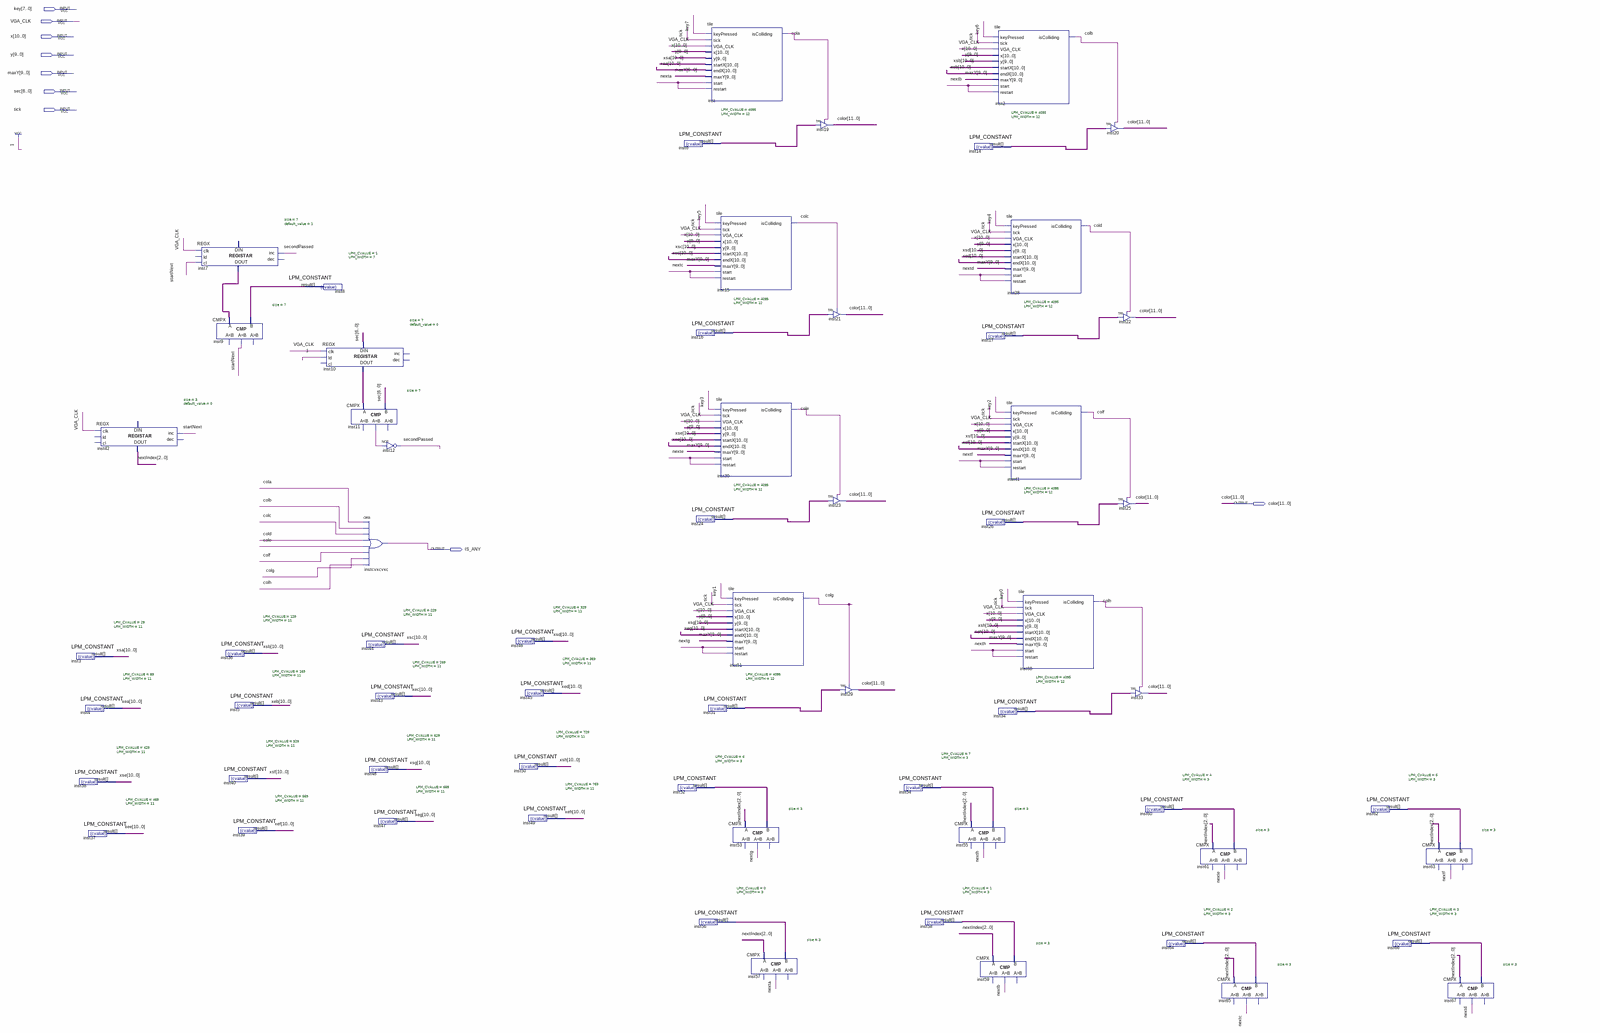
[diagram p0: schematic sheet, whole]
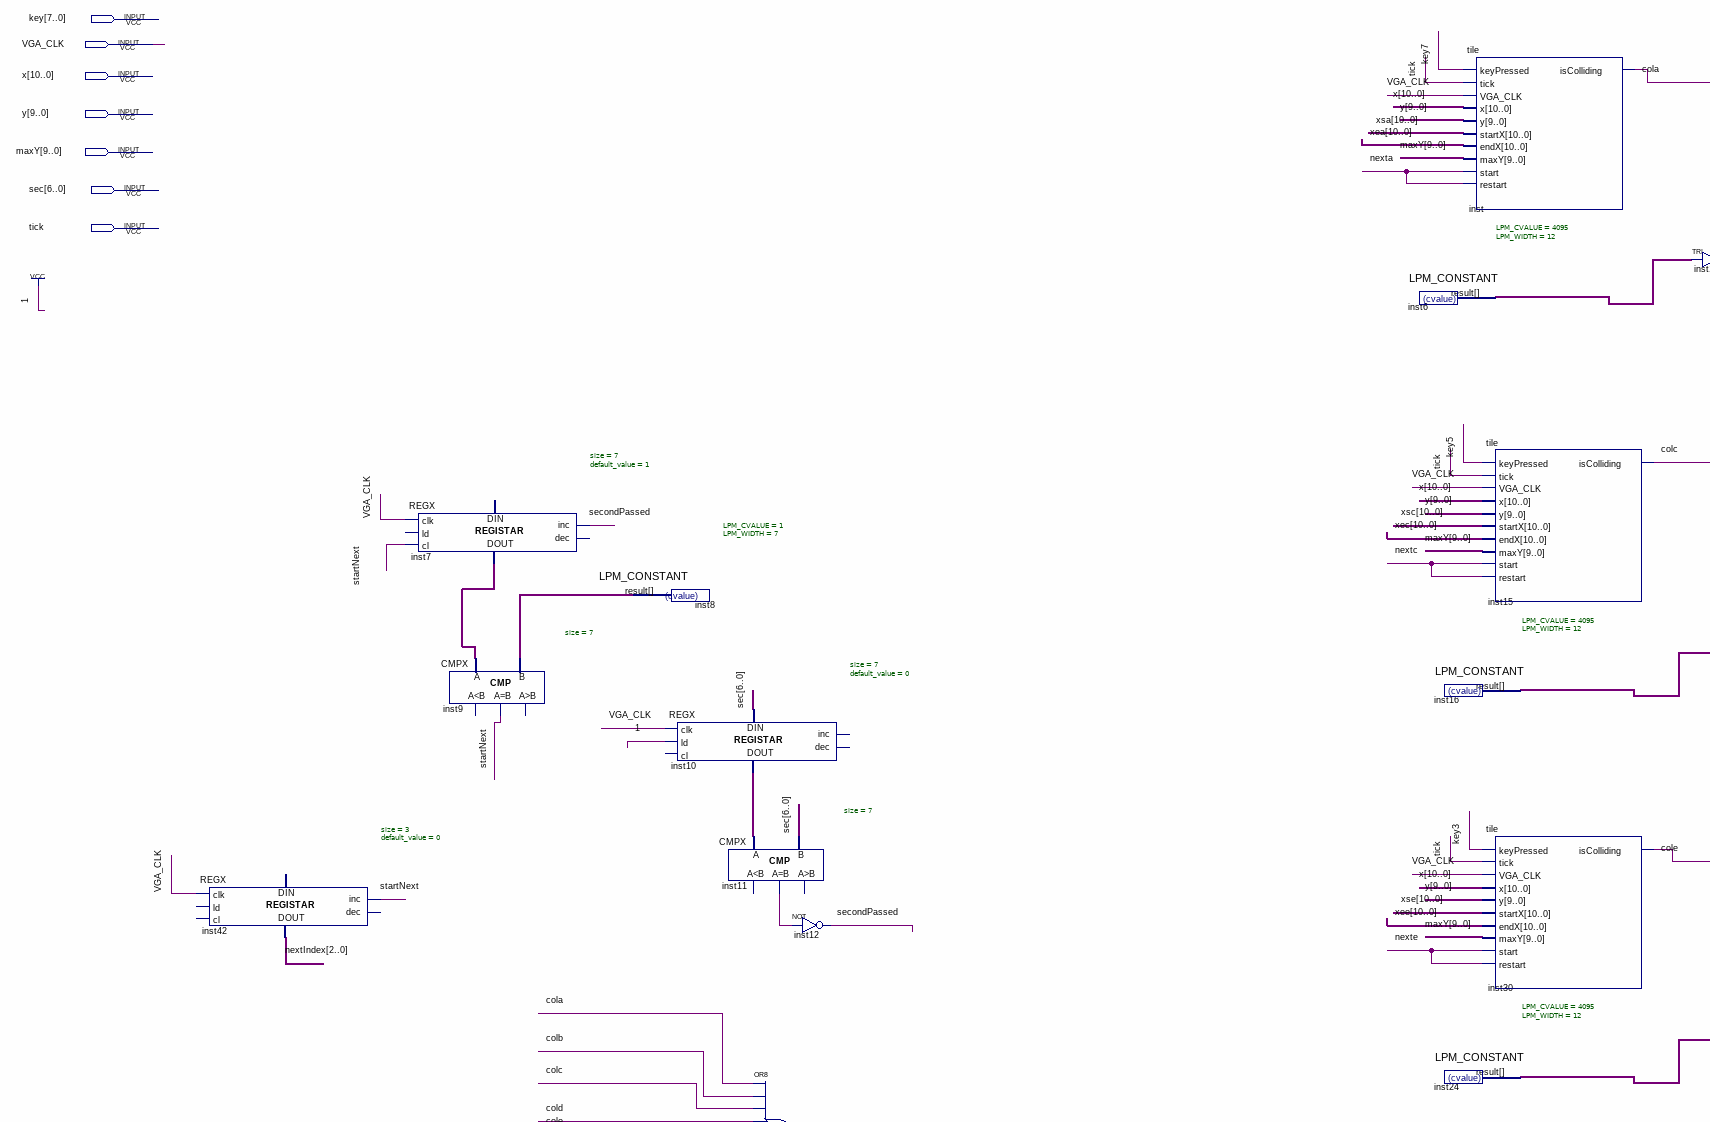
[diagram p1: schematic sheet, upper left part]
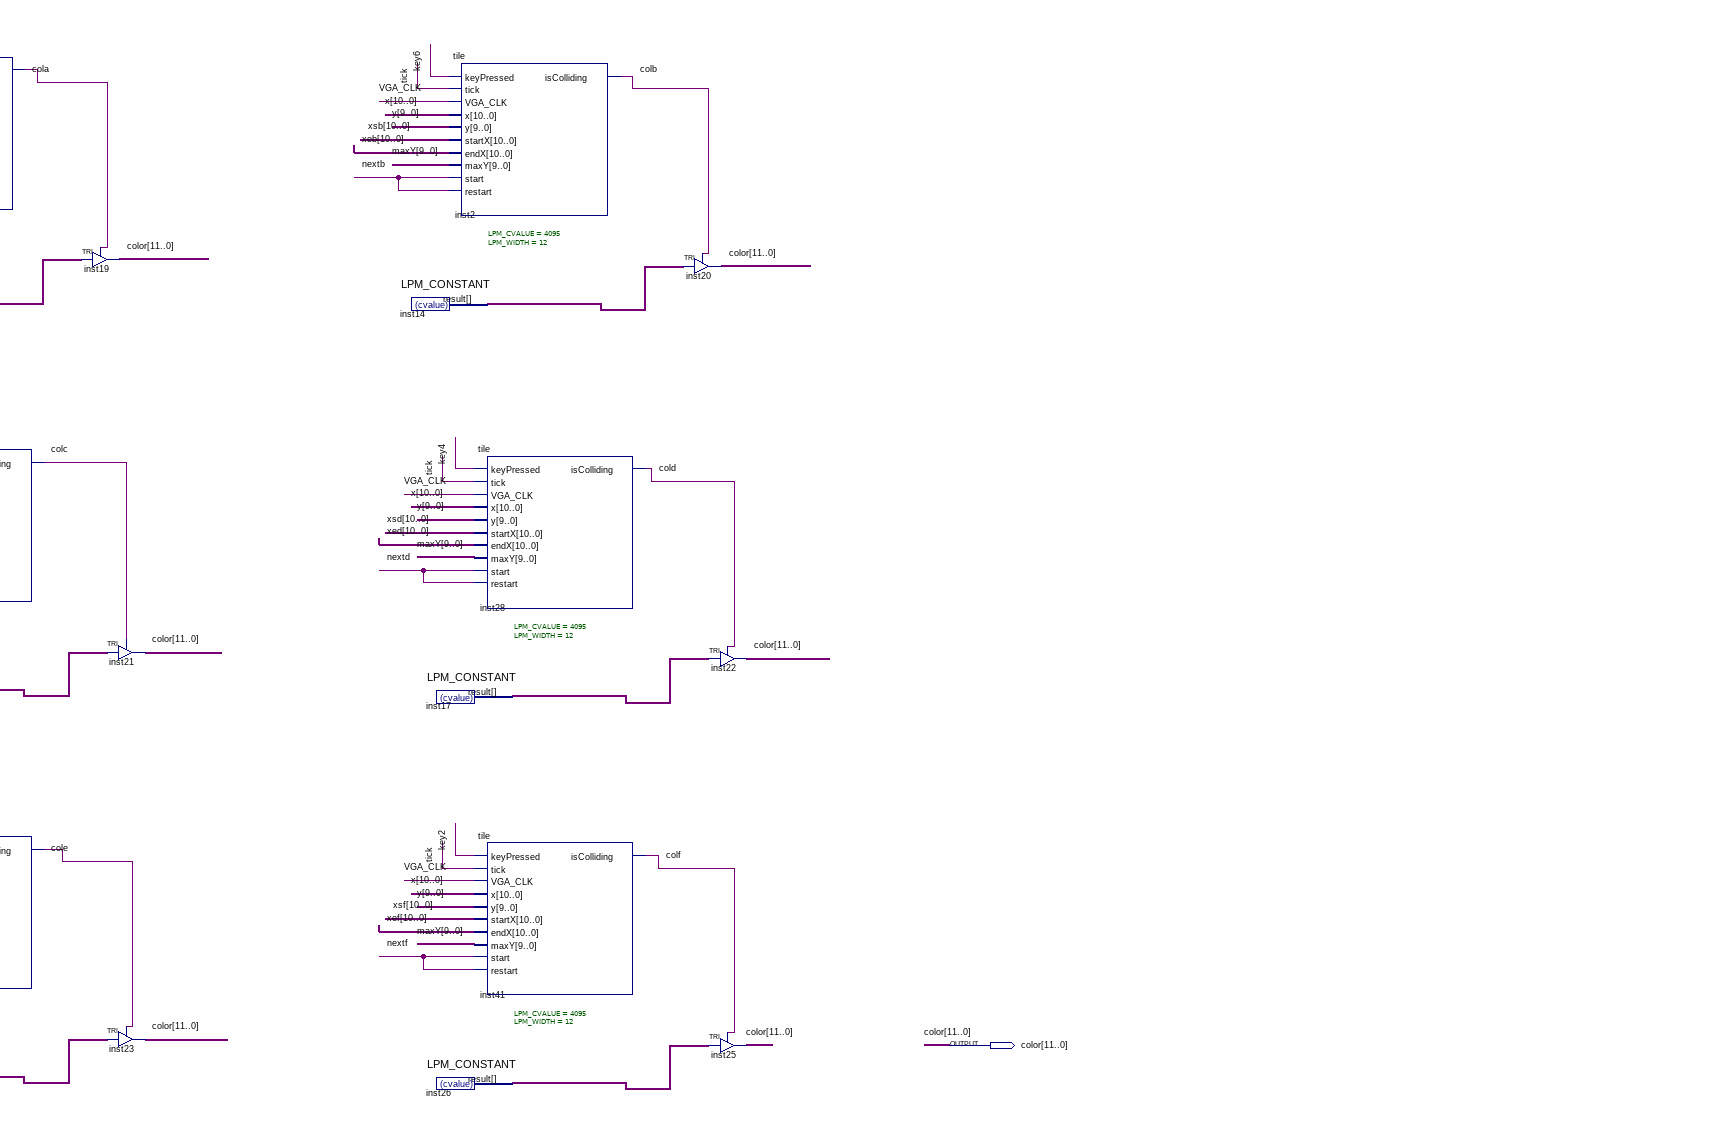
[diagram p2: schematic sheet, upper right part]
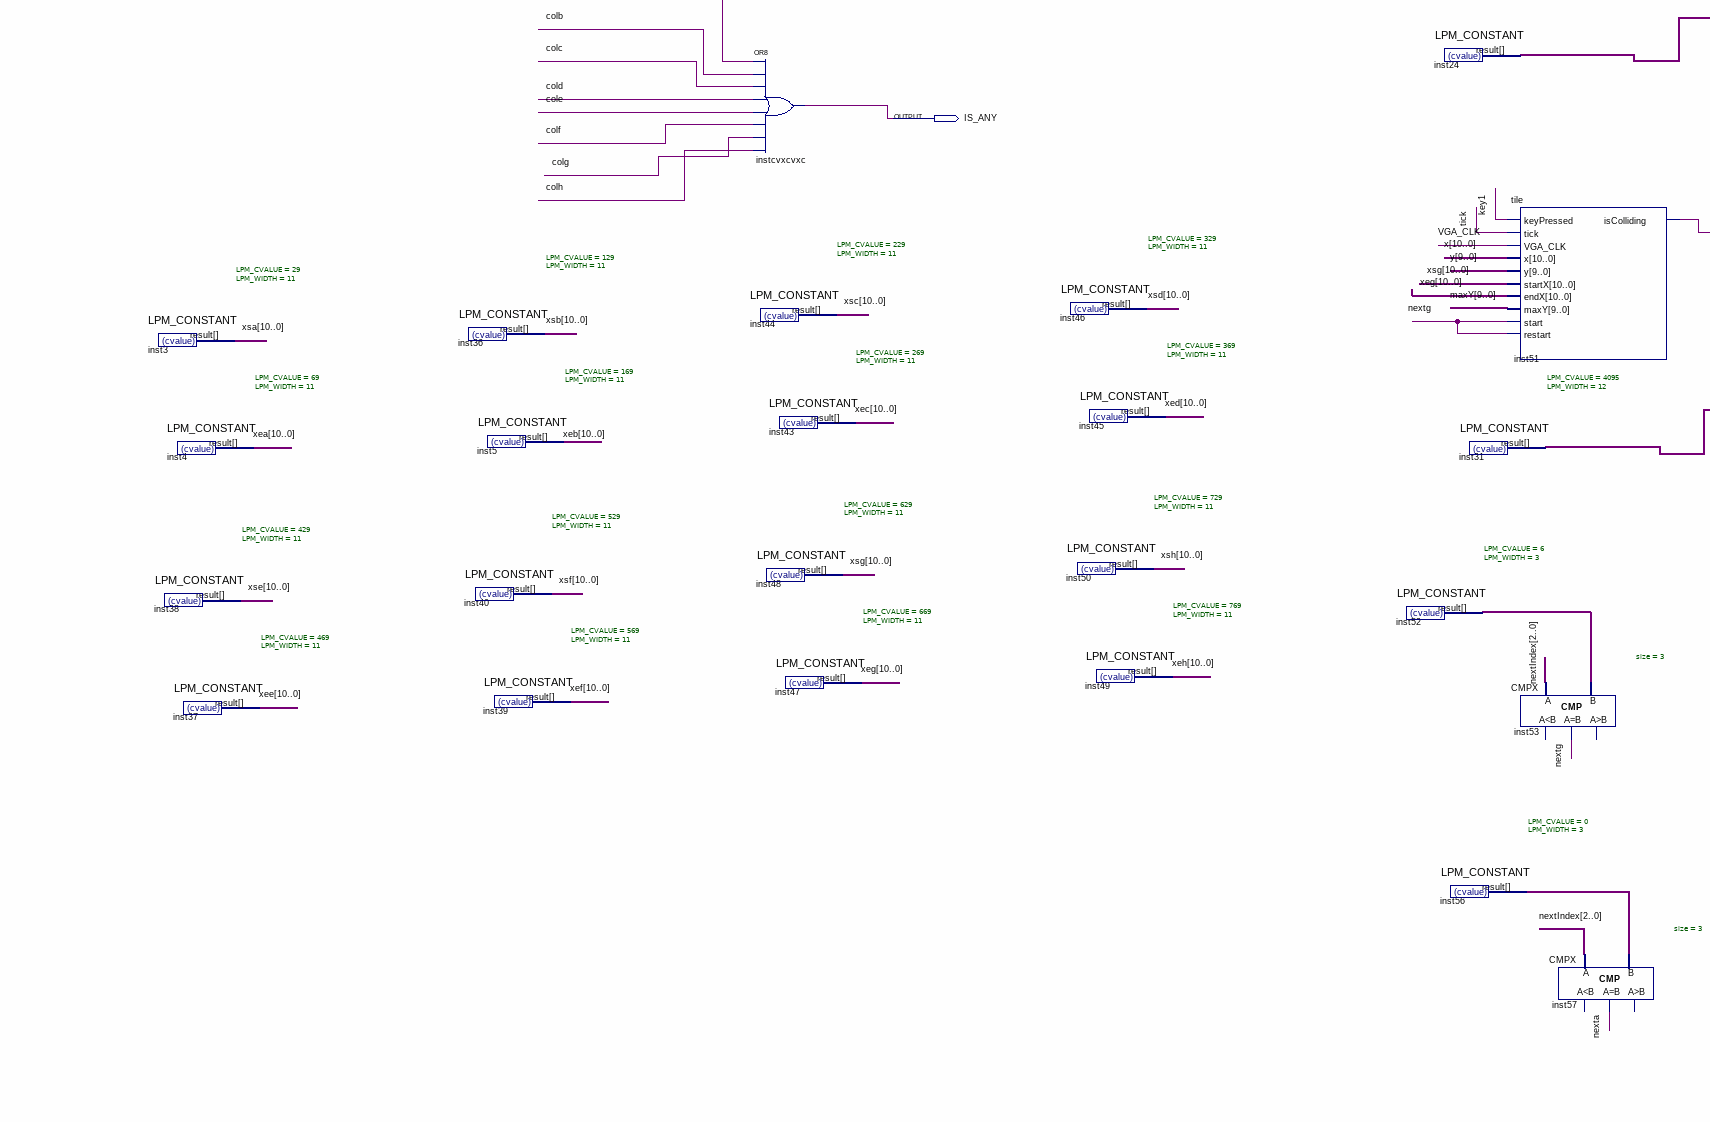
[diagram p3: schematic sheet, lower left part]
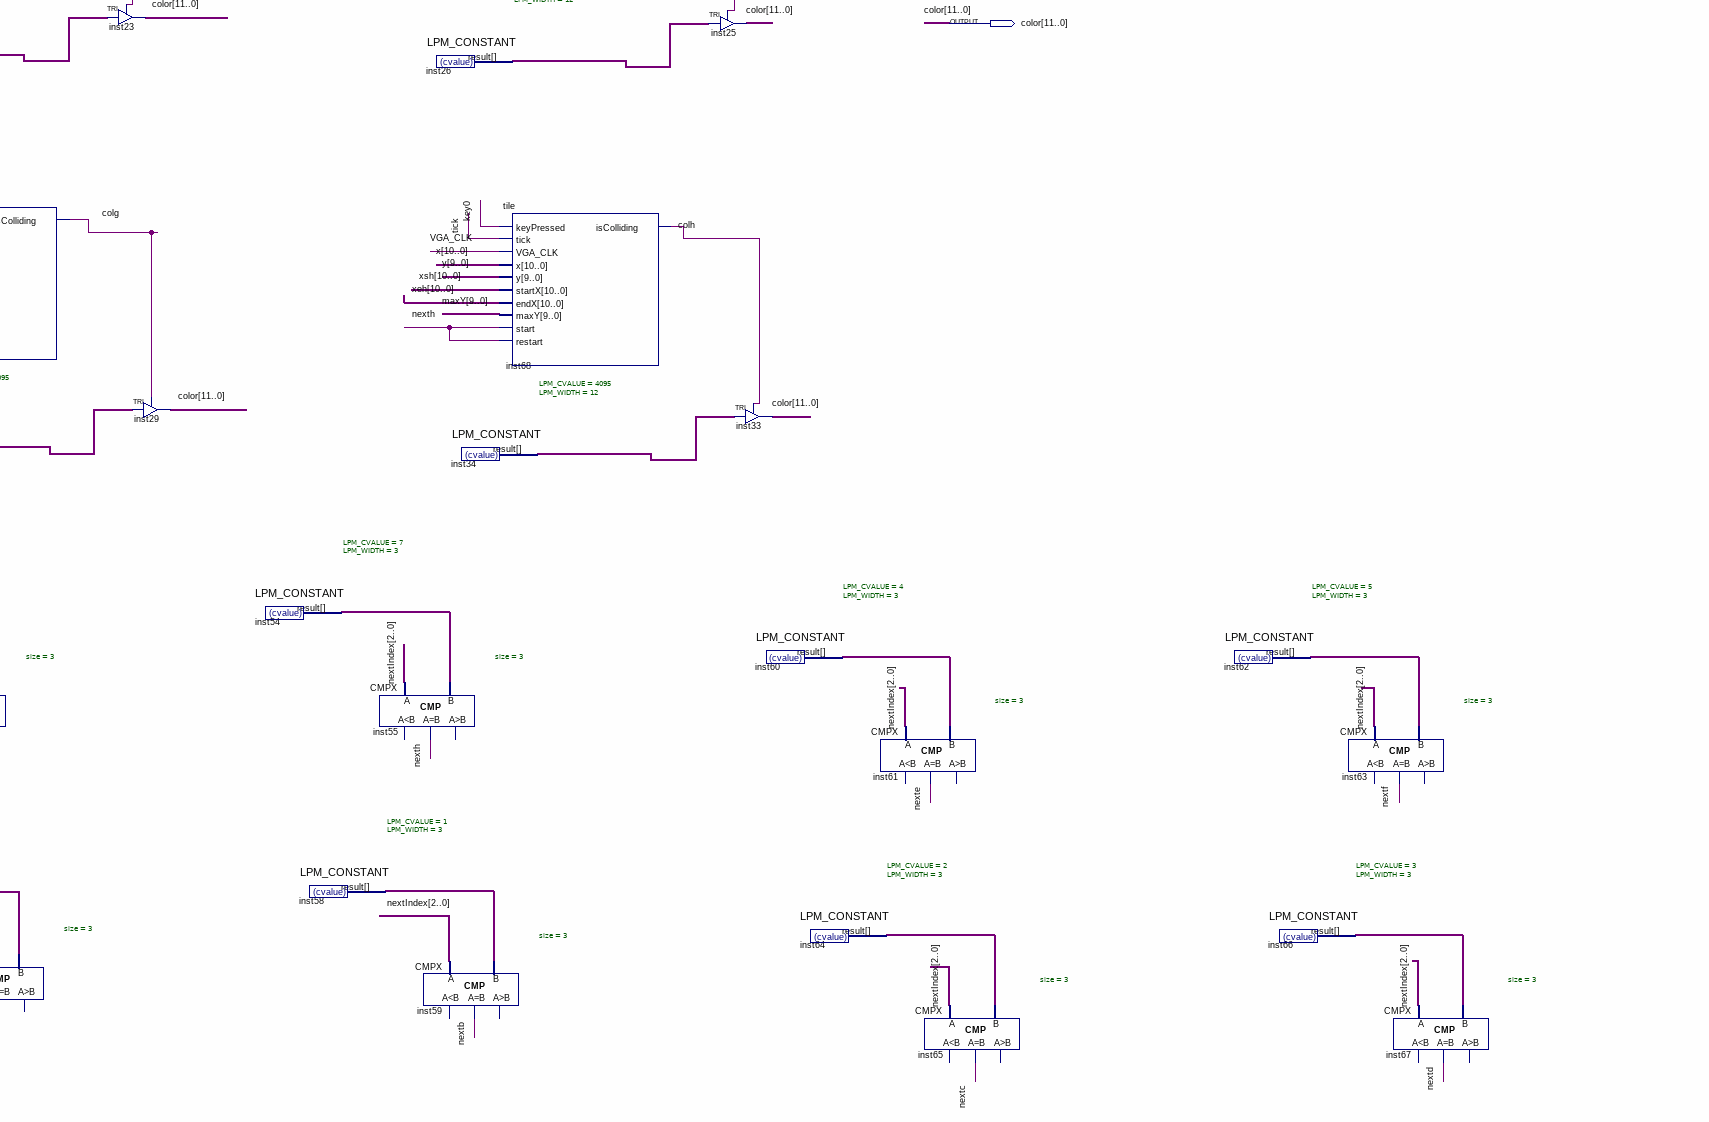
[diagram p4: schematic sheet, lower right part]
// Quartus schematic tiles.bdf as structural Verilog: 64 symbols, 9 pins
module tiles (
  input  [7:0] key,
  input  VGA_CLK,
  input  [10:0] x,
  input  [9:0] y,
  input  [9:0] maxY,
  input  [6:0] sec,
  input  tick,
  output [11:0] color,
  output IS_ANY
);

  wire cola, colb, colc, cold, cole, colf, colg, colh, inst11_eq, nexta, nextb, nextc, nextd, nexte, nextf,
       nextg, nexth, secondPassed, startNext;
  wire [2:0] inst52_result, inst54_result, inst56_result, inst58_result, inst60_result, inst62_result,
       inst64_result, inst66_result, nextIndex;
  wire [6:0] inst7_data_out, inst8_result, inst10_data_out;
  wire [10:0] xea, xeb, xec, xed, xee, xef, xeg, xeh, xsa, xsb, xsc, xsd, xse, xsf, xsg, xsh;
  wire [11:0] inst6_result, inst14_result, inst16_result, inst17_result, inst24_result, inst26_result,
       inst31_result, inst34_result;

  LPM_CONSTANT #(.LPM_CVALUE(29), .LPM_WIDTH(11)) inst3 (.result(xsa));
  LPM_CONSTANT #(.LPM_CVALUE(69), .LPM_WIDTH(11)) inst4 (.result(xea));
  LPM_CONSTANT #(.LPM_CVALUE(429), .LPM_WIDTH(11)) inst38 (.result(xse));
  REGX #(.size(3), .default_value(0)) inst42 (
    .clk(VGA_CLK), .inc(startNext), .data_out(nextIndex));  // open: ld, cl, dec, data_in
  LPM_CONSTANT #(.LPM_CVALUE(469), .LPM_WIDTH(11)) inst37 (.result(xee));
  REGX #(.size(7), .default_value(1)) inst7 (
    .clk(VGA_CLK), .cl(startNext), .inc(secondPassed), .data_out(inst7_data_out));  // open: ld, dec, data_in
  CMPX #(.size(7)) inst9 (.A(inst7_data_out), .B(inst8_result), .eq(startNext));  // open: ls, gr
  LPM_CONSTANT #(.LPM_CVALUE(129), .LPM_WIDTH(11)) inst36 (.result(xsb));
  LPM_CONSTANT #(.LPM_CVALUE(529), .LPM_WIDTH(11)) inst40 (.result(xsf));
  LPM_CONSTANT #(.LPM_CVALUE(169), .LPM_WIDTH(11)) inst5 (.result(xeb));
  LPM_CONSTANT #(.LPM_CVALUE(569), .LPM_WIDTH(11)) inst39 (.result(xef));
  LPM_CONSTANT #(.LPM_CVALUE(1), .LPM_WIDTH(7)) inst8 (.result(inst8_result));
  REGX #(.size(7), .default_value(0)) inst10 (
    .clk(VGA_CLK), .ld(1'b1), .data_in(sec), .data_out(inst10_data_out));  // open: cl, inc, dec
  CMPX #(.size(7)) inst11 (.A(inst10_data_out), .B(sec), .eq(inst11_eq));  // open: ls, gr
  or instcvxcvxc (IS_ANY, cola, colb, colc, cold, cole, colf, colg, colh);
  LPM_CONSTANT #(.LPM_CVALUE(229), .LPM_WIDTH(11)) inst44 (.result(xsc));
  LPM_CONSTANT #(.LPM_CVALUE(269), .LPM_WIDTH(11)) inst43 (.result(xec));
  LPM_CONSTANT #(.LPM_CVALUE(629), .LPM_WIDTH(11)) inst48 (.result(xsg));
  LPM_CONSTANT #(.LPM_CVALUE(669), .LPM_WIDTH(11)) inst47 (.result(xeg));
  not inst12 (secondPassed, inst11_eq);
  LPM_CONSTANT #(.LPM_CVALUE(329), .LPM_WIDTH(11)) inst46 (.result(xsd));
  LPM_CONSTANT #(.LPM_CVALUE(369), .LPM_WIDTH(11)) inst45 (.result(xed));
  LPM_CONSTANT #(.LPM_CVALUE(729), .LPM_WIDTH(11)) inst50 (.result(xsh));
  LPM_CONSTANT #(.LPM_CVALUE(769), .LPM_WIDTH(11)) inst49 (.result(xeh));
  LPM_CONSTANT #(.LPM_CVALUE(4095), .LPM_WIDTH(12)) inst6 (.result(inst6_result));
  LPM_CONSTANT #(.LPM_CVALUE(4095), .LPM_WIDTH(12)) inst16 (.result(inst16_result));
  LPM_CONSTANT #(.LPM_CVALUE(4095), .LPM_WIDTH(12)) inst24 (.result(inst24_result));
  LPM_CONSTANT #(.LPM_CVALUE(6), .LPM_WIDTH(3)) inst52 (.result(inst52_result));
  tile inst (
    .keyPressed(key[7]), .tick(tick), .VGA_CLK(VGA_CLK), .x(x), .y(y), .startX(xsa), .endX(xea), .maxY(maxY),
    .start(nexta), .restart(nexta), .isColliding(cola));
  tile inst15 (
    .keyPressed(key[5]), .tick(tick), .VGA_CLK(VGA_CLK), .x(x), .y(y), .startX(xsc), .endX(xec), .maxY(maxY),
    .start(nextc), .restart(nextc), .isColliding(colc));
  tile inst30 (
    .keyPressed(key[3]), .tick(tick), .VGA_CLK(VGA_CLK), .x(x), .y(y), .startX(xse), .endX(xee), .maxY(maxY),
    .start(nexte), .restart(nexte), .isColliding(cole));
  LPM_CONSTANT #(.LPM_CVALUE(4095), .LPM_WIDTH(12)) inst31 (.result(inst31_result));
  LPM_CONSTANT #(.LPM_CVALUE(0), .LPM_WIDTH(3)) inst56 (.result(inst56_result));
  tile inst51 (
    .keyPressed(key[1]), .tick(tick), .VGA_CLK(VGA_CLK), .x(x), .y(y), .startX(xsg), .endX(xeg), .maxY(maxY),
    .start(nextg), .restart(nextg), .isColliding(colg));
  CMPX #(.size(3)) inst53 (.A(nextIndex), .B(inst52_result), .eq(nextg));  // open: ls, gr
  CMPX #(.size(3)) inst57 (.A(nextIndex), .B(inst56_result), .eq(nexta));  // open: ls, gr
  TRI inst19[11:0] (.IN(inst6_result), .OE(cola), .OUT(color));
  TRI inst21[11:0] (.IN(inst16_result), .OE(colc), .OUT(color));
  TRI inst23[11:0] (.IN(inst24_result), .OE(cole), .OUT(color));
  TRI inst29[11:0] (.IN(inst31_result), .OE(colg), .OUT(color));
  LPM_CONSTANT #(.LPM_CVALUE(7), .LPM_WIDTH(3)) inst54 (.result(inst54_result));
  LPM_CONSTANT #(.LPM_CVALUE(1), .LPM_WIDTH(3)) inst58 (.result(inst58_result));
  CMPX #(.size(3)) inst55 (.A(nextIndex), .B(inst54_result), .eq(nexth));  // open: ls, gr
  LPM_CONSTANT #(.LPM_CVALUE(4095), .LPM_WIDTH(12)) inst14 (.result(inst14_result));
  LPM_CONSTANT #(.LPM_CVALUE(4095), .LPM_WIDTH(12)) inst17 (.result(inst17_result));
  LPM_CONSTANT #(.LPM_CVALUE(4095), .LPM_WIDTH(12)) inst26 (.result(inst26_result));
  CMPX #(.size(3)) inst59 (.A(nextIndex), .B(inst58_result), .eq(nextb));  // open: ls, gr
  tile inst2 (
    .keyPressed(key[6]), .tick(tick), .VGA_CLK(VGA_CLK), .x(x), .y(y), .startX(xsb), .endX(xeb), .maxY(maxY),
    .start(nextb), .restart(nextb), .isColliding(colb));
  tile inst28 (
    .keyPressed(key[4]), .tick(tick), .VGA_CLK(VGA_CLK), .x(x), .y(y), .startX(xsd), .endX(xed), .maxY(maxY),
    .start(nextd), .restart(nextd), .isColliding(cold));
  tile inst41 (
    .keyPressed(key[2]), .tick(tick), .VGA_CLK(VGA_CLK), .x(x), .y(y), .startX(xsf), .endX(xef), .maxY(maxY),
    .start(nextf), .restart(nextf), .isColliding(colf));
  LPM_CONSTANT #(.LPM_CVALUE(4095), .LPM_WIDTH(12)) inst34 (.result(inst34_result));
  tile inst68 (
    .keyPressed(key[0]), .tick(tick), .VGA_CLK(VGA_CLK), .x(x), .y(y), .startX(xsh), .endX(xeh), .maxY(maxY),
    .start(nexth), .restart(nexth), .isColliding(colh));
  TRI inst20[11:0] (.IN(inst14_result), .OE(colb), .OUT(color));
  TRI inst22[11:0] (.IN(inst17_result), .OE(cold), .OUT(color));
  TRI inst25[11:0] (.IN(inst26_result), .OE(colf), .OUT(color));
  TRI inst33[11:0] (.IN(inst34_result), .OE(colh), .OUT(color));
  LPM_CONSTANT #(.LPM_CVALUE(4), .LPM_WIDTH(3)) inst60 (.result(inst60_result));
  LPM_CONSTANT #(.LPM_CVALUE(2), .LPM_WIDTH(3)) inst64 (.result(inst64_result));
  CMPX #(.size(3)) inst61 (.A(nextIndex), .B(inst60_result), .eq(nexte));  // open: ls, gr
  CMPX #(.size(3)) inst65 (.A(nextIndex), .B(inst64_result), .eq(nextc));  // open: ls, gr
  LPM_CONSTANT #(.LPM_CVALUE(5), .LPM_WIDTH(3)) inst62 (.result(inst62_result));
  LPM_CONSTANT #(.LPM_CVALUE(3), .LPM_WIDTH(3)) inst66 (.result(inst66_result));
  CMPX #(.size(3)) inst63 (.A(nextIndex), .B(inst62_result), .eq(nextf));  // open: ls, gr
  CMPX #(.size(3)) inst67 (.A(nextIndex), .B(inst66_result), .eq(nextd));  // open: ls, gr
endmodule
